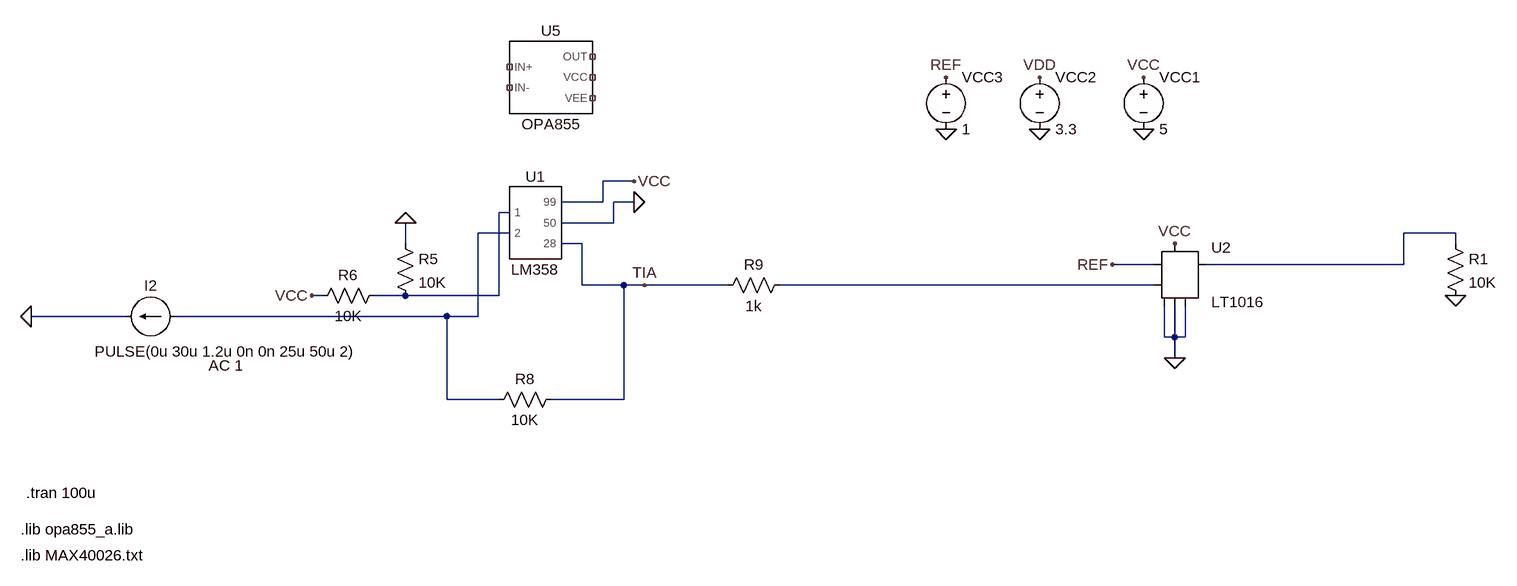
[diagram p0: schematic receiver.asc]
receiver.asc, the LTspice schematic file:
Version 4.1
SHEET 1 3604 1172
WIRE 144 -112 96 -112
WIRE 96 -80 96 -112
WIRE 96 -80 32 -80
WIRE 144 -80 112 -80
WIRE -48 -64 -64 -64
WIRE 112 -48 112 -80
WIRE 112 -48 32 -48
WIRE -48 -32 -96 -32
WIRE 1408 -32 1328 -32
WIRE -208 -16 -208 -48
WIRE 64 -16 32 -16
WIRE 1408 -16 1408 -32
WIRE 944 16 880 16
WIRE 1328 16 1328 -32
WIRE 1328 16 1024 16
WIRE 64 48 64 -16
WIRE 128 48 64 48
WIRE 160 48 128 48
WIRE 288 48 160 48
WIRE 944 48 368 48
WIRE -336 64 -352 64
WIRE -208 64 -256 64
WIRE -64 64 -64 -64
WIRE -64 64 -208 64
WIRE -640 96 -784 96
WIRE -144 96 -560 96
WIRE -96 96 -96 -32
WIRE -96 96 -144 96
WIRE 960 128 960 80
WIRE 976 128 976 80
WIRE 976 128 960 128
WIRE 992 128 992 80
WIRE 992 128 976 128
WIRE 976 160 976 128
WIRE -144 224 -144 96
WIRE -64 224 -144 224
WIRE 128 224 128 48
WIRE 128 224 16 224
FLAG -208 -48 0
FLAG -352 64 VCC
FLAG 144 -80 0
FLAG 144 -112 VCC
FLAG 880 16 REF
FLAG 976 -16 VCC
FLAG 976 160 0
FLAG 160 48 TIA
FLAG 928 -272 VCC
FLAG 928 -192 0
FLAG 768 -272 VDD
FLAG 768 -192 0
FLAG 624 -272 REF
FLAG 624 -192 0
FLAG -784 96 0
FLAG 1408 64 0
SYMBOL current -560 96 R90
WINDOW 0 -32 40 VBottom 2
WINDOW 3 38 -76 VTop 2
WINDOW 123 60 -76 VTop 2
WINDOW 39 0 0 Left 0
SYMATTR InstName I2
SYMATTR Value PULSE(0u 30u 1.2u 0n 0n 25u 50u 2)
SYMATTR Value2 AC 1
SYMBOL res -224 -32 R0
SYMATTR InstName R5
SYMATTR Value 10K
SYMBOL res -240 48 R90
WINDOW 0 0 56 VBottom 2
WINDOW 3 32 56 VTop 2
SYMATTR InstName R6
SYMATTR Value 10K
SYMBOL res 32 208 R90
WINDOW 0 0 56 VBottom 2
WINDOW 3 32 56 VTop 2
SYMATTR InstName R8
SYMATTR Value 10K
SYMBOL res 384 32 R90
WINDOW 0 0 56 VBottom 2
WINDOW 3 32 56 VTop 2
SYMATTR InstName R9
SYMATTR Value 1k
SYMBOL OPA855 16 -272 R0
SYMATTR InstName U5
SYMBOL voltage 928 -288 R0
WINDOW 123 0 0 Left 0
WINDOW 39 0 0 Left 0
SYMATTR InstName VCC1
SYMATTR Value 5
SYMBOL voltage 768 -288 R0
WINDOW 123 0 0 Left 0
WINDOW 39 0 0 Left 0
SYMATTR InstName VCC2
SYMATTR Value 3.3
SYMBOL voltage 624 -288 R0
WINDOW 123 0 0 Left 0
WINDOW 39 0 0 Left 0
SYMATTR InstName VCC3
SYMATTR Value 1
SYMBOL LM358 -16 -48 R0
SYMATTR InstName U1
SYMBOL Comparators\\LT1016 976 -32 R0
SYMATTR InstName U2
SYMBOL res 1392 -32 R0
SYMATTR InstName R1
SYMATTR Value 10K
SYMATTR SpiceLine tol=1 pwr=0.1
TEXT -792 368 Left 2 !.tran 100u
TEXT -800 424 Left 2 !.lib opa855_a.lib
TEXT -800 464 Left 2 !.lib MAX40026.txt

The netlist it stands for:
* receiver.asc
I2 N002 0 PULSE(0u 30u 1.2u 0n 0n 25u 50u 2) AC 1
R5 0 N001 10K
R6 N001 VCC 10K
R8 TIA N002 10K
R9 N004 TIA 1k
X§U5 NC_01 NC_02 NC_03 NC_04 NC_05 OPA855  ; pins IN+ IN- OUT VCC VEE
VCC1 VCC 0 5
VCC2 VDD 0 3.3
VCC3 REF 0 1
X§U1 N001 N002 VCC 0 TIA LM358  ; pins 1 2 99 50 28
X§U2 VCC N004 REF 0 0 0 N003 NC_06 LT1016
R1 N003 0 10K tol=1 pwr=0.1
.tran 100u
.lib opa855_a.lib
.lib MAX40026.txt
.lib D:\C\1\lm358.lib
.lib LTC.lib
.backanno
.end